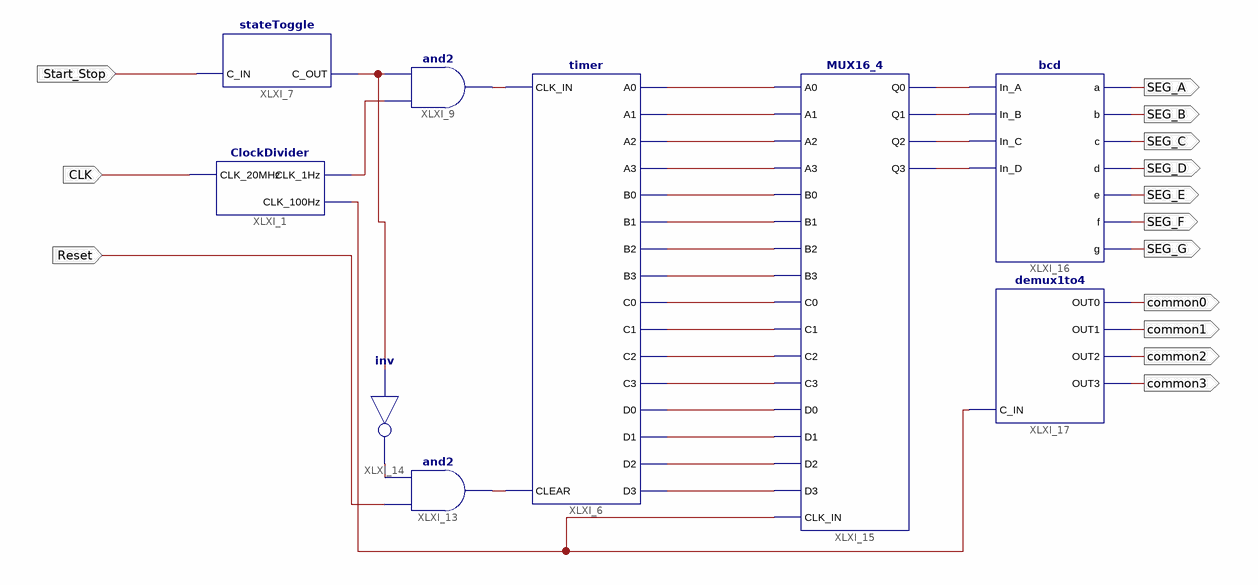
[diagram p0: schematic sheet 1]
// Xilinx ISE schematic main.sch (spartan6) as structural Verilog: 9 symbols, 14 ports
module main (
  input  Start_Stop,
  input  Reset,
  input  CLK,
  output SEG_A,
  output SEG_B,
  output SEG_C,
  output SEG_D,
  output SEG_E,
  output SEG_F,
  output SEG_G,
  output common0,
  output common1,
  output common2,
  output common3
);

  wire XLXN_8, XLXN_9, XLXN_11, XLXN_12, XLXN_13, XLXN_16, XLXN_17, XLXN_18, XLXN_19, XLXN_20, XLXN_21,
       XLXN_22, XLXN_23, XLXN_24, XLXN_25, XLXN_26, XLXN_27, XLXN_28, XLXN_29, XLXN_30, XLXN_31, XLXN_33,
       XLXN_34, XLXN_35, XLXN_36, XLXN_51;

  timer XLXI_6 (
    .A0(XLXN_16), .A1(XLXN_17), .A2(XLXN_18), .A3(XLXN_19), .B0(XLXN_20), .B1(XLXN_21), .B2(XLXN_22),
    .B3(XLXN_23), .C0(XLXN_24), .C1(XLXN_25), .C2(XLXN_26), .C3(XLXN_27), .CLK_IN(XLXN_8), .D0(XLXN_28),
    .D1(XLXN_29), .D2(XLXN_30), .D3(XLXN_31), .CLEAR(XLXN_12));
  and XLXI_9 (XLXN_8, XLXN_11, XLXN_9);
  stateToggle XLXI_7 (.C_IN(Start_Stop), .C_OUT(XLXN_9));
  and XLXI_13 (XLXN_12, Reset, XLXN_13);
  not XLXI_14 (XLXN_13, XLXN_9);
  MUX16_4 XLXI_15 (
    .A0(XLXN_16), .A1(XLXN_17), .A2(XLXN_18), .A3(XLXN_19), .B0(XLXN_20), .B1(XLXN_21), .B2(XLXN_22),
    .B3(XLXN_23), .C0(XLXN_24), .C1(XLXN_25), .C2(XLXN_26), .C3(XLXN_27), .CLK_IN(XLXN_51), .D0(XLXN_28),
    .D1(XLXN_29), .D2(XLXN_30), .D3(XLXN_31), .Q0(XLXN_33), .Q1(XLXN_34), .Q2(XLXN_35), .Q3(XLXN_36));
  bcd XLXI_16 (
    .a(SEG_A), .b(SEG_B), .c(SEG_C), .d(SEG_D), .e(SEG_E), .f(SEG_F), .g(SEG_G), .In_A(XLXN_33),
    .In_B(XLXN_34), .In_C(XLXN_35), .In_D(XLXN_36));
  demux1to4 XLXI_17 (.OUT0(common0), .OUT1(common1), .OUT2(common2), .OUT3(common3), .C_IN(XLXN_51));
  ClockDivider XLXI_1 (.CLK_100Hz(XLXN_51), .CLK_1Hz(XLXN_11), .CLK_20MHz(CLK));

  // Notes on the sheet:
  //   CLOCK_DEDICATED_ROUTE on signal Start_Stop = FALSE
endmodule
